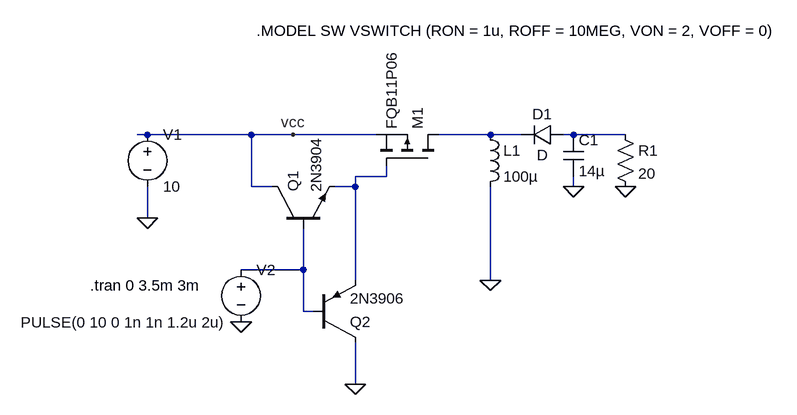
[diagram p0: schematic buck-boost.asc]
buck-boost.asc, the LTspice schematic file:
Version 4
SHEET 1 880 680
WIRE -304 112 -320 112
WIRE -144 112 -304 112
WIRE -80 112 -144 112
WIRE 48 112 -80 112
WIRE 224 112 144 112
WIRE 272 112 224 112
WIRE 352 112 336 112
WIRE 432 112 352 112
WIRE 64 176 64 160
WIRE 64 176 16 176
WIRE -144 192 -144 112
WIRE -112 192 -144 192
WIRE 16 192 16 176
WIRE 16 192 -16 192
WIRE 352 192 352 176
WIRE -304 240 -304 192
WIRE -64 320 -64 256
WIRE -64 320 -160 320
WIRE 16 336 16 192
WIRE 224 336 224 192
WIRE -64 384 -64 320
WIRE -48 384 -64 384
WIRE 16 496 16 432
FLAG 224 336 0
FLAG 352 192 0
FLAG 432 192 0
FLAG -304 240 0
FLAG 16 496 0
FLAG -160 400 0
FLAG -80 112 vcc
SYMBOL ind 208 96 R0
SYMATTR InstName L1
SYMATTR Value 100µ
SYMBOL res 416 96 R0
SYMATTR InstName R1
SYMATTR Value 20
SYMBOL cap 336 112 R0
SYMATTR InstName C1
SYMATTR Value 14µ
SYMBOL voltage -304 96 R0
WINDOW 123 0 0 Left 0
WINDOW 39 0 0 Left 0
SYMATTR InstName V1
SYMATTR Value 10
SYMBOL pmos 144 160 M270
SYMATTR InstName M1
SYMATTR Value FQB11P06
SYMBOL voltage -160 304 R0
WINDOW 3 -339 97 Left 0
WINDOW 123 0 0 Left 0
WINDOW 39 0 0 Left 0
SYMATTR Value PULSE(0 10 0 1n 1n 1.2u 2u)
SYMATTR InstName V2
SYMBOL diode 336 96 R90
WINDOW 0 0 32 VBottom 0
WINDOW 3 32 32 VTop 0
SYMATTR InstName D1
SYMBOL npn -112 256 R270
SYMATTR InstName Q1
SYMATTR Value 2N3904
SYMBOL pnp -48 432 M180
SYMATTR InstName Q2
SYMATTR Value 2N3906
TEXT -392 344 Left 0 !.tran 0 3.5m 3m
TEXT -136 -48 Left 0 !.MODEL SW VSWITCH (RON = 1u, ROFF = 10MEG, VON = 2, VOFF = 0)

The netlist it stands for:
* buck-boost.asc
L1 N001 0 100µ
R1 N002 0 20
C1 N002 0 14µ
V1 vcc 0 10
M1 N001 N003 vcc vcc FQB11P06
V2 N004 0 PULSE(0 10 0 1n 1n 1.2u 2u)
D1 N002 N001 D
Q1 vcc N004 N003 0 2N3904
Q2 0 N004 N003 0 2N3906
.model D D
.lib standard.dio
.model NPN NPN
.model PNP PNP
.lib standard.bjt
.model NMOS NMOS
.model PMOS PMOS
.lib standard.mos
.tran 0 3.5m 3m
.MODEL SW VSWITCH (RON = 1u, ROFF = 10MEG, VON = 2, VOFF = 0)
.backanno
.end